# EAGLE design CC2-32KEC-V1RA1 (EAGLE 5.10)
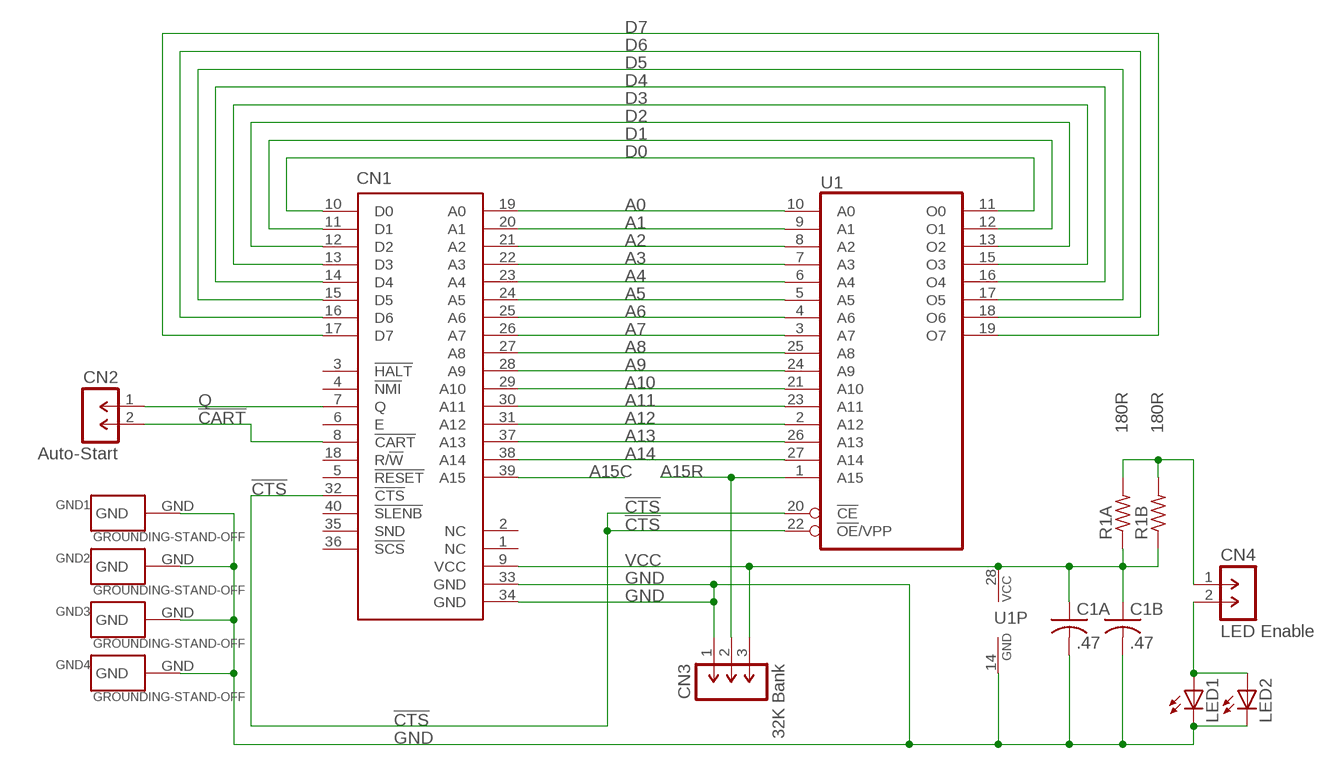
[diagram p0: schematic, sheet 1]

## Parts
C1A  .47  NP-CAPACITOR-C050-025X075  [C050-025X075]
C1B  .47  NP-CAPACITOR-C1206K  [C1206K]
CN1  COCO3-CARTRIDGE-PLUG-SHORT  [EDGE-CARD-PLUG-2X20-100-SHORT]
CN2  Auto-Start  1X02-SIP-100-32  [SIL1X02-100]
CN3  32K Bank  1X03-SIP-100-32  [SIL1X03-100]
CN4  LED Enable  1X02-SIP-100-32  [SIL1X02-100]
GND1  GROUNDING-STAND-OFF  [STAND-OFF]
GND2  GROUNDING-STAND-OFF  [STAND-OFF]
GND3  GROUNDING-STAND-OFF  [STAND-OFF]
GND4  GROUNDING-STAND-OFF  [STAND-OFF]
LED1  LED5MM  [LED5MM]
LED2  LEDSMT1206  [1206]
R1A  180R  R-US_0207/10  [0207/10]
R1B  180R  R-US_M1206  [M1206]
U1  27C512D-MINIMAL-OUTLINE  [DIL28-6-MINIMAL-OUTLINE]

## Nets
!CART: CN1.8(!CART) CN2.2
!CTS: CN1.32(!CTS) U1.20(!CE) U1.22(!OE!/VPP)
A0: CN1.19(A0) U1.10(A0)
A1: CN1.20(A1) U1.9(A1)
A2: CN1.21(A2) U1.8(A2)
A3: CN1.22(A3) U1.7(A3)
A4: CN1.23(A4) U1.6(A4)
A5: CN1.24(A5) U1.5(A5)
A6: CN1.25(A6) U1.4(A6)
A7: CN1.26(A7) U1.3(A7)
A8: CN1.27(A8) U1.25(A8)
A9: CN1.28(A9) U1.24(A9)
A10: CN1.29(A10) U1.21(A10)
A11: CN1.30(A11) U1.23(A11)
A12: CN1.31(A12) U1.2(A12)
A13: CN1.37(A13) U1.26(A13)
A14: CN1.38(A14) U1.27(A14)
A15C: CN1.39(A15)
A15R: CN3.2 U1.1(A15)
D0: CN1.10(D0) U1.11(O0)
D1: CN1.11(D1) U1.12(O1)
D2: CN1.12(D2) U1.13(O2)
D3: CN1.13(D3) U1.15(O3)
D4: CN1.14(D4) U1.16(O4)
D5: CN1.15(D5) U1.17(O5)
D6: CN1.16(D6) U1.18(O6)
D7: CN1.17(D7) U1.19(O7)
GND [power]: C1A.2(-) C1B.2(-) CN1.33(GND) CN1.34(GND) CN3.1 GND1.GND GND2.GND GND3.GND GND4.GND LED1.K(C) LED2.C U1.14(GND)
N$1: CN4.1 R1A.2 R1B.2
N$2: CN4.2 LED1.A LED2.A
Q: CN1.7(Q) CN2.1
VCC [power]: C1A.1(+) C1B.1(+) CN1.9(VCC) CN3.3 R1A.1 R1B.1 U1.28(VCC)
Unconnected: CN1.1(NC) CN1.2(NC) CN1.3(!HALT) CN1.4(!NMI) CN1.5(!RESET) CN1.6(E) CN1.18(R/!W) CN1.35(SND) CN1.36(!SCS) CN1.40(!SLENB)

## Library data of the parts
C1A C1B = RetroZilla.org-Capacitor:NP-CAPACITOR: NON-POLARIZED CAPACITOR grid 5mm
CN1 = RetroZilla.org-TRS-80-CoCo-3-Program-Pak-Cartridge:COCO3-CARTRIDGE-PLUG: CoCo 3 Program Pak Cartridge Plug - http://www.GIMEchip.com/ Tandy Radio Shack TRS-80 Color Computer 3 Program Pak Cartridge Plug (Edge-Card) E.A.G.L.E. Library Part created by John Eric Turner & His Father - sales@gimechip.com <mailto:sales@gimechip.com?subject=Tandy Radio Shack TRS- 80 Color Computer 3 Program Pak Cartridge Plug (Edge-Card) E.A.G.L.E. Library Part> 40-Pin Edge-Card sharing the same pinout as the Program Pak Cartridge Edge-Card Connector. This library part has been designed to provide a 40-pin cartridge plug connector matching the CoCo's Edge-Card connector (Cartridge Slot). This library part is also useful with the Dragon and other CoCo clones. It is important to note that the CoCo 2 & 3 only provide +5V at the cartridge connector. The CoCo 1 provides +5V AND +/-12V at the cartridge connector. The Dragon provides only +5V and +12V at the cartridge connector. The table below lists all similarities and differences between these machines, relevant to the cartridge slot: PIN # TRS-80 "CoCo 1" Function Tano/Dragon Data "Dragon 32/64" Function TRS-80 "CoCo 2 & 3" Function 1 -12V +12V NC 2 +12V +12V NC 3 HALT* HALT* HALT* 4 NMI* NMI* NMI* 5 RESET* RESET* RESET* 6 E E E 7 Q Q Q 8 CART* CART* CART* 9 +5V +5V +5V 10 D0 D0 D0 11 D1 D1 D1 12 D2 D2 D2 13 D3 D3 D3 14 D4 D4 D4 15 D5 D5 D5 16 D6 D6 D6 17 D7 D7 D7 18 R/W* R/W* R/W* 19 A0 A0 A0 20 A1 A1 A1 21 A2 A2 A2 22 A3 A3 A3 23 A4 A4 A4 24 A5 A5 A5 25 A6 A6 A6 26 A7 A7 A7 27 A8 A8 A8 28 A9 A9 A9 29 A10 A10 A10 30 A11 A11 A11 31 A12 A12 A12 32 CTS* CSEL* CTS* 33 GND GND GND 34 GND GND GND 35 SND SND SND 36 SCS* P2* SCS* 37 A13 A13 A13 38 A14 A14 A14 39 A15 A15 A15 40 SLENB* DSD* SLENB*
CN2 CN4 = RetroZilla.org-Header-Generic:1X02: MALE HEADER
CN3 = RetroZilla.org-Header-Generic:1X03: MALE HEADER
GND1-GND4 = RetroZilla.org-TRS-80-CoCo-3-Program-Pak-Cartridge:GROUNDING
LED1 LED2 = RetroZilla.org-LED:LED: LED OSRAM: - CHIPLED LG R971, LG N971, LY N971, LG Q971, LY Q971, LO R971, LY R971 LH N974, LH R974 LS Q976, LO Q976, LY Q976 LO Q996 - Hyper CHIPLED LW Q18S LB Q993, LB Q99A, LB R99A - SideLED LS A670, LO A670, LY A670, LG A670, LP A670 LB A673, LV A673, LT A673, LW A673 LH A674 LY A675 LS A676, LA A676, LO A676, LY A676, LW A676 LS A679, LY A679, LG A679 - Hyper Micro SIDELED® LS Y876, LA Y876, LO Y876, LY Y876 LT Y87S - SmartLED LW L88C, LW L88S LB L89C, LB L89S, LG L890 LS L89K, LO L89K, LY L89K LS L896, LA L896, LO L896, LY L896 - TOPLED LS T670, LO T670, LY T670, LG T670, LP T670 LSG T670, LSP T670, LSY T670, LOP T670, LYG T670 LG T671, LOG T671, LSG T671 LB T673, LV T673, LT T673, LW T673 LH T674 LS T676, LA T676, LO T676, LY T676, LB T676, LH T676, LSB T676, LW T676 LB T67C, LV T67C, LT T67C, LS T67K, LO T67K, LY T67K, LW E67C LS E67B, LA E67B, LO E67B, LY E67B, LB E67C, LV E67C, LT E67C LW T67C LS T679, LY T679, LG T679 LS T770, LO T770, LY T770, LG T770, LP T770 LB T773, LV T773, LT T773, LW T773 LH T774 LS E675, LA E675, LY E675, LS T675 LS T776, LA T776, LO T776, LY T776, LB T776 LHGB T686 LT T68C, LB T68C - Hyper Mini TOPLED® LB M676 - Mini TOPLED Santana® LG M470 LS M47K, LO M47K, LY M47K Source: http://www.osram.convergy.de/
R1A R1B = RetroZilla.org-RCL:R-US_: RESISTOR, American symbol
U1 = RetroZilla.org-EPROM:27C512D: MEMORY

## Net classes
0 default: width 0.203 mm, clearance 0.203 mm
1 power: width 0.635 mm, clearance 0.203 mm

## Board
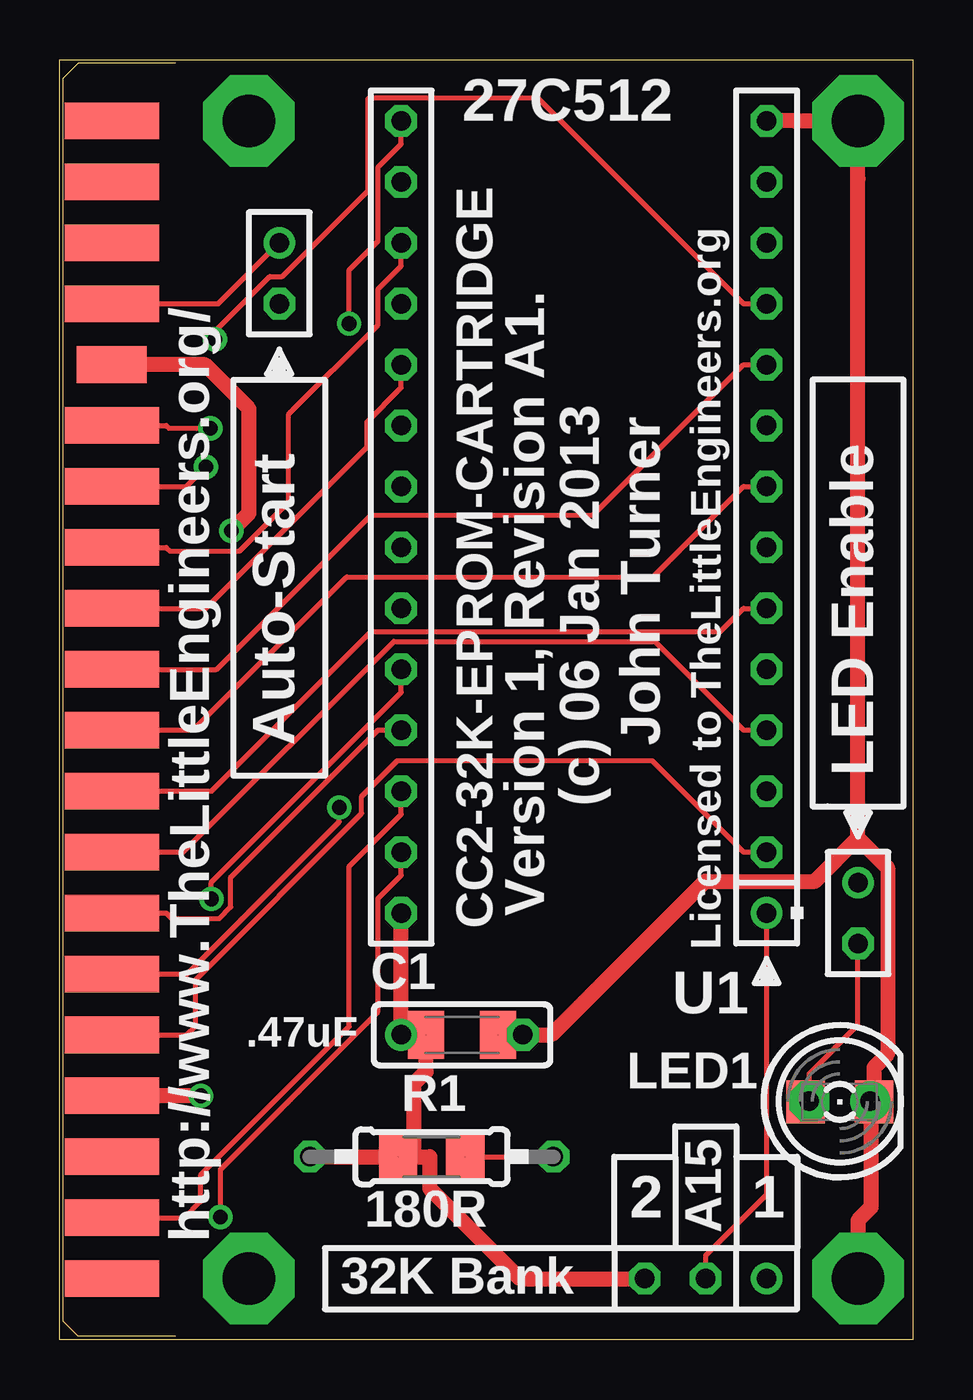
[diagram p1: board, top side]
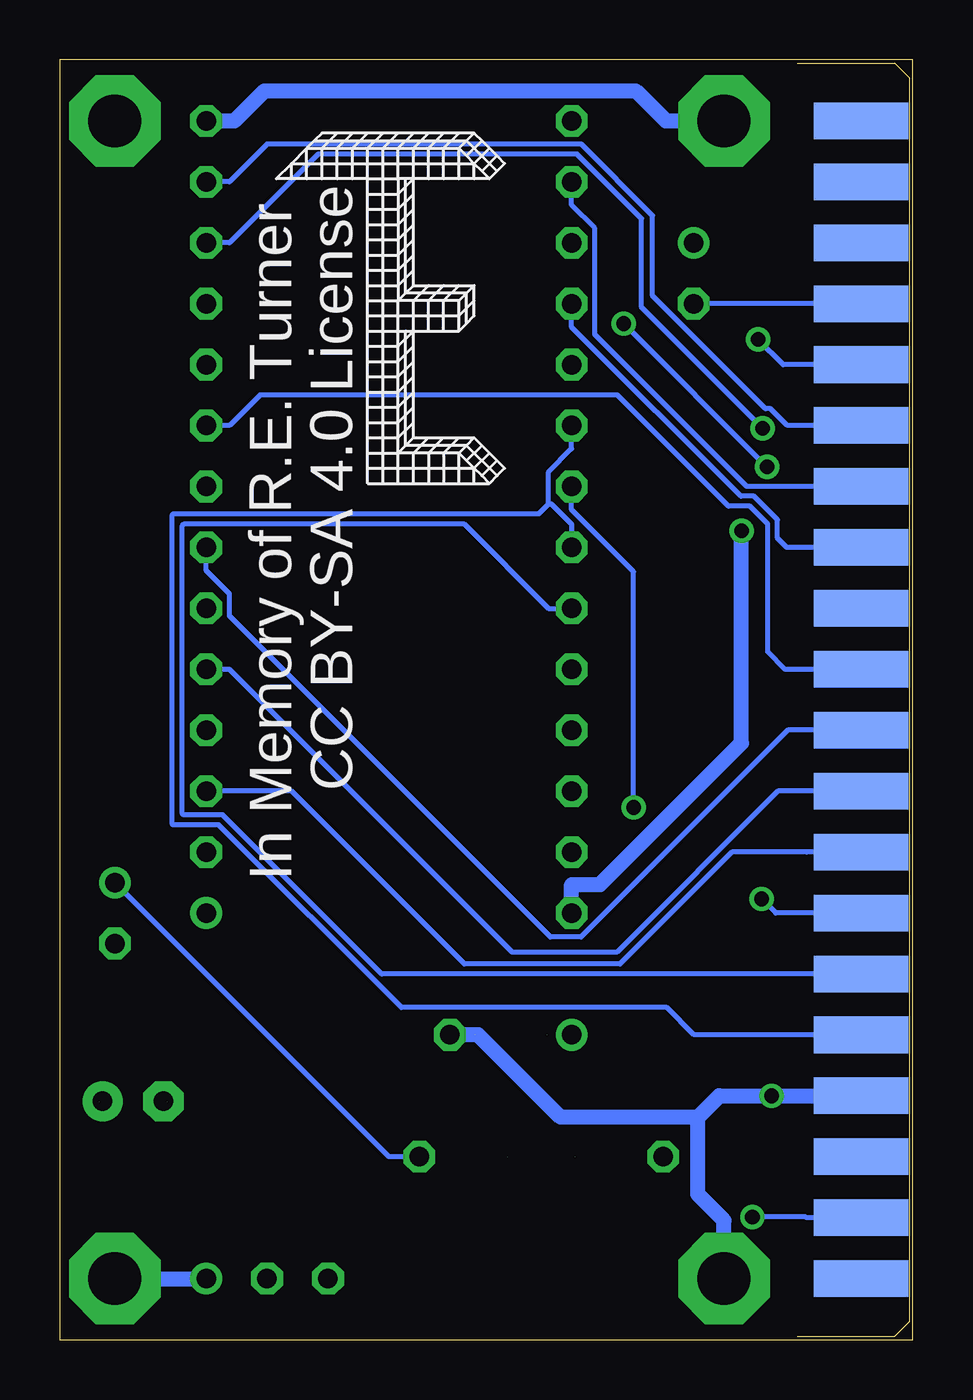
[diagram p2: board, bottom side, seen from below]

Size 35.56 x 53.34 mm. Coordinates in mm from the lower left corner, seen from the top.
Outline: 0,53.34 35.56,53.34 35.56,0 0,0 0,53.34
Copper layers (1*16): Top 0.035mm / dielectric 1.5mm / Bottom 0.035mm
Design rules "default": minimum track width 10mil, minimum drill 24mil, track to track 8mil, track to pad 8mil, pad to pad 8mil, via to via 8mil, smd to smd 8mil, copper to edge 40mil, drill to drill 8mil, minimum pad ring 10mil, minimum via ring 8mil, stop-mask expansion 4mil, vias tented up to drill 0mil, thermal gap 10mil
vRestrict: area 15.5,14 to 28.2,53.3; area 23.1,3.8 to 30.7,7.6; area 9.1,0 to 23.1,5.1; area 30.7,20.3 to 35.8,48.3; area 7.9,16.5 to 10.4,41.9

### Footprints (pad centres in the part's own frame; a part is rotated, then mirrored left to right if it is on the bottom)
C050-025X075 = drill 0.813 round: 1 -2.54,0 | drill 0.813 octagon: 2 2.54,0
C1206K = smd 1.5 x 2: 1 -1.5,0; 2 1.5,0
EDGE-CARD-PLUG-2X20-100-SHORT = smd 3.937 x 1.524: 1 3.175,24.13; 3 3.175,21.59; 5 3.175,19.05; 7 3.175,16.51; 11 3.175,11.43; 13 3.175,8.89; 15 3.175,6.35; 17 3.175,3.81; 19 3.175,1.27; 21 3.175,-1.27; 23 3.175,-3.81; 25 3.175,-6.35; 27 3.175,-8.89; 29 3.175,-11.43; 31 3.175,-13.97; 33 3.175,-16.51; 35 3.175,-19.05; 37 3.175,-21.59; 39 3.175,-24.13 | smd 3.937 x 1.524 bottom: 2 3.175,24.13; 4 3.175,21.59; 6 3.175,19.05; 8 3.175,16.51; 10 3.175,13.97; 12 3.175,11.43; 14 3.175,8.89; 16 3.175,6.35; 18 3.175,3.81; 20 3.175,1.27; 22 3.175,-1.27; 24 3.175,-3.81; 26 3.175,-6.35; 28 3.175,-8.89; 30 3.175,-11.43; 32 3.175,-13.97; 34 3.175,-16.51; 36 3.175,-19.05; 38 3.175,-21.59; 40 3.175,-24.13 | smd 2.921 x 1.524: 9 3.175,13.97
SIL1X02-100 = drill 0.813 round: 1 -1.27,0 | drill 0.813 octagon: 2 1.27,0
SIL1X03-100 = drill 0.813 round: 1 -2.54,0 | drill 0.813 octagon: 2 0,0; 3 2.54,0
STAND-OFF = drill 2.2 pad 3.81 octagon: GND 0,0
LED5MM = drill 0.813 pad 1.676 octagon: A -1.27,0 | drill 0.813 pad 1.676 round: K 1.27,0
1206 = smd 1.6 x 1.803: A -1.422,0; C 1.422,0
0207/10 = drill 0.813 octagon: 1 -5.08,0; 2 5.08,0
M1206 = smd 1.6 x 2: 1 -1.4,0; 2 1.4,0
DIL28-6-MINIMAL-OUTLINE = drill 0.813 round: 1 -16.51,-7.62 | drill 0.813 octagon: 2 -13.97,-7.62; 3 -11.43,-7.62; 4 -8.89,-7.62; 5 -6.35,-7.62; 6 -3.81,-7.62; 7 -1.27,-7.62; 8 1.27,-7.62; 9 3.81,-7.62; 10 6.35,-7.62; 11 8.89,-7.62; 12 11.43,-7.62; 13 13.97,-7.62; 14 16.51,-7.62; 15 16.51,7.62; 16 13.97,7.62; 17 11.43,7.62; 18 8.89,7.62; 19 6.35,7.62; 20 3.81,7.62; 21 1.27,7.62; 22 -1.27,7.62; 23 -3.81,7.62; 24 -6.35,7.62; 25 -8.89,7.62; 26 -11.43,7.62; 27 -13.97,7.62; 28 -16.51,7.62

### Placement (x,y rotation side)
C1A  16.76,12.7 0 top
C1B  16.76,12.7 0 top
CN1  -1.02,26.67 0 top
CN2  9.14,44.45 270 top
CN3  26.92,2.54 180 top
CN4  33.27,17.78 270 top
GND1  7.87,50.8 0 top
GND2  33.27,50.8 0 top
GND3  7.87,2.54 0 top
GND4  33.27,2.54 0 top
LED1  32.51,9.93 0 top
LED2  32.51,9.91 0 top
R1A  15.49,7.62 0 top
R1B  15.49,7.62 0 top
U1  21.84,34.29 90 top
U$1  [TLE-LOGO-10]  26.54,35.69 0 bottom

### Tracks (layer width: path | path; a pad name or v marks a point on that pad's centre or on a via)
!CART
  Bottom 0.203: CN1.8 CN2.2
!CTS
  Bottom 0.203: 15.19,34.83 15.19,36.16 14.22,37.13 U1.20 | 15.19,34.83 15.07,34.83 14.22,33.99 U1.22 | 15.19,34.83 15.6,34.43 30.82,34.43 30.88,34.37 30.88,21.49 30.85,21.46 28.94,21.46 21.32,13.84 10.26,13.84 9.12,12.7 CN1.32
A0
  Top 0.203: U1.10 28.5,40.64 22.23,34.37 12.97,34.37 6.54,27.94 CN1.19
A1
  Bottom 0.203: U1.9 28.5,38.1 27.22,39.38 12.32,39.38 7.69,34.74 6.79,34.74 6.05,34 6.05,28.68 5.32,27.94 CN1.20
A2
  Top 0.203: CN1.21 5.56,25.4 11.95,31.79 24.73,31.79 28.5,35.56 U1.8
A3
  Bottom 0.203: U1.7 29.46,32.05 28.5,31.09 28.5,30.16 15.12,16.78 13.84,16.78 5.22,25.4 CN1.22
A4
  Top 0.203: U1.6 28.5,30.48 27.53,29.51 12.98,29.51 6.33,22.86 CN1.23
A5
  Bottom 0.203: CN1.24 5.63,22.86 12.34,16.15 16.7,16.15 28.5,27.94 U1.5
A6
  Top 0.203: U1.4 28.5,25.4 24.8,29.1 13.92,29.1 5.14,20.32 CN1.25
A7
  Bottom 0.203: CN1.26 4.44,20.32 7.54,20.32 12.21,15.65 18.7,15.65 25.91,22.86 U1.3
A8
  Top 0.203: CN1.27 4.44,17.78 4.66,17.55 6.65,17.55 7.12,18.03 7.12,19.27 13.26,25.4 U1.25
A9  (via drill 0.61 pad 1.02)
  Top 0.203: U1.24 14.22,26.97 6.31,19.06 v6.31,18.37
  Bottom 0.203: v6.31,18.37 5.72,17.78 CN1.28
A10  (via drill 0.61 pad 1.02)
  Top 0.203: v11.64,22.18 11.64,21.58 5.31,15.24 CN1.29
  Bottom 0.203: U1.21 14.22,34.59 11.64,32.01 v11.64,22.18
A11
  Bottom 0.203: U1.23 15.19,30.48 18.72,34.01 30.38,34.01 30.46,33.92 30.46,21.93 30.41,21.87 28.77,21.87 22.14,15.24 CN1.30
A12
  Top 0.203: U1.2 28.5,20.32 24.69,24.13 14.07,24.13 12.58,22.64 12.58,21.93 5.65,15 5.65,13.08 5.27,12.7 CN1.31
A13
  Top 0.203: CN1.37 5.2,5.08 5.87,5.76 5.87,6.86 12.06,13.04 12.06,19.73 14.22,21.89 U1.26
A14  (via drill 0.61 pad 1.02)
  Top 0.203: U1.27 14.22,19.35 13.26,18.38 13.26,13.66 6.69,7.1 v6.69,5.11
  Bottom 0.203: CN1.38 4.44,5.08 4.46,5.11 v6.69,5.11
A15R
  Top 0.203: CN3.2 26.92,3.51 29.46,6.05 U1.1
D0  (via drill 0.61 pad 1.02)
  Top 0.203: U1.11 28.5,43.18 19.91,51.77 12.9,51.77 12.84,51.71 12.84,47.9 9.26,44.31 8.74,44.31 6.45,42.02 v6.45,41.69
  Bottom 0.203: v6.45,41.69 5.4,40.64 CN1.10
D1  (via drill 0.61 pad 1.02)
  Top 0.203: CN1.11 4.44,38.1 4.55,37.99 v6.27,37.99
  Bottom 0.203: U1.12 28.5,45.72 24.8,49.42 14,49.42 11.31,46.73 11.31,43.03 v6.27,37.99
D2
  Bottom 0.203: CN1.12 5.23,38.1 5.93,38.8 6.14,38.8 10.85,43.51 10.85,46.86 13.83,49.83 26.93,49.83 28.5,48.26 U1.13
D3  (via drill 0.61 pad 1.02)
  Top 0.203: v12.05,42.35 12.05,44.59 13.26,45.79 13.26,48.87 14.22,49.83 U1.15 | CN1.13 5.27,35.56 v6.08,36.38
  Bottom 0.203: v6.08,36.38 v12.05,42.35
D4
  Bottom 0.203: CN1.14 4.44,35.56 6.92,35.56 13.26,41.9 13.26,46.32 14.22,47.29 U1.16
D5
  Top 0.203: CN1.15 4.44,33.02 4.59,32.86 7.48,32.86 9.54,34.92 9.54,38.58 13.26,42.29 13.26,43.79 14.22,44.75 U1.17
D6
  Bottom 0.203: CN1.16 5.26,33.02 5.64,33.4 5.64,34.17 6.62,35.15 7.16,35.15 14.22,42.21 U1.18
D7
  Top 0.203: U1.19 14.22,39.67 12.8,38.25 12.8,37.2 6.08,30.48 CN1.17
GND  (via drill 0.61 pad 1.02)  (2 unrouted)
  Top 0.635: v5.88,10.16 4.65,10.16 CN1.34 | 33.81,9.91 LED1.K | 33.81,9.91 LED2.C 33.93,11.33 34.51,11.91 34.51,19.67 33.27,20.9 | 33.81,9.91 33.81,5.5 33.27,4.97 GND4.GND | U1.14 30.65,50.8 30.67,50.78 33.27,50.78 | 33.27,50.78 33.27,48.37 33.27,20.9 | 33.27,50.78 GND2.GND | 33.27,20.9 31.48,19.11 26.89,19.11 20.49,12.7 C1A.2 C1B.2
  Bottom 0.635: CN1.34 v5.88,10.16 8.07,10.16 8.96,9.26 | 8.96,9.26 14.68,9.26 18.12,12.7 C1A.2 | 8.96,9.26 8.96,6.06 7.87,4.97 GND3.GND | GND4.GND CN3.1 | GND1.GND 10.3,50.8 11.55,52.05 27.03,52.05 28.28,50.8 U1.14
N$1  (1 unrouted)
  Top 0.203: R1B.2 R1A.2
  Bottom 0.203: R1A.2 21.84,7.62 CN4.1
N$2  (1 unrouted)
  Top 0.203: CN4.2 33.27,13.11 31.24,11.08 LED1.A 31.22,9.91 LED2.A
Q
  Top 0.203: CN2.1 6.6,43.18 CN1.7
VCC  (via drill 0.61 pad 1.02)  (2 unrouted)
  Top 0.635: CN1.9 6.04,40.64 7.88,38.8 7.88,34.45 v7.14,33.71 | 14.76,7.62 14.76,10.67 15.26,11.18 C1B.1 C1A.1 U1.28 | 14.76,7.62 15.42,7.62 15.42,6.3 19.18,2.54 CN3.3 | 14.76,7.62 R1B.1 11.6,7.62 R1A.1
  Bottom 0.635: v7.14,33.71 7.14,24.86 13.04,18.96 14.22,18.96 U1.28

### Text on the board
tNames: GND1 | GND2 | 27C512 | GROUNDING-STAND-OFF | GROUNDING-STAND-OFF | Auto-Start | CN2 | CN4 | LED Enable | C1A | .47 | C1B | R1A | R1B | CN1 | Auto-Start | John Turner | LED Enable | (c) 06 Jan 2013 | 1K8 | 1K8 | GND3 | Version 1, Revision A1. | GROUNDING-STAND-OFF | CC2-32K-EPROM-CARTRIDGE | GROUNDING-STAND-OFF | Licensed to TheLittleEngineers.org | C1 | GND4 | U1 | 32K Bank | .47uF | CN3 | LED1 | LED2 | R1 | 180R | 2 | A15 | 1 | http://www.TheLittleEngineers.org/ | 32K Bank
bNames: CC BY-SA 4.0 License | In Memory of R.E. Turner | John | Turner | Copr. (c) | 06 Jan 2013